# Altium schematic sheet Thermal_CCM.SchDoc: =project_title
size Tabloid; PageSetup: Record=PageOptions|CenterHorizontal=True|CenterVertical=True|PrintScale=0.71|XCorrection=1.00|YCorrection=1.00|PrintKind=0|BorderSize=5000000|LeftOffset=0|BottomOffset=0|Orientation=2|PaperLength=1000|PaperWidth=1000|Scale=100|PaperSource=7|PrintQuality=-4|MediaType=1|DitherType=10|PrintScaleMode=1|PaperKind=A4; CompanyName: Luxonis Holding; Organization: Luxonis Holding; Address1: 1925 Harmony Park Drive; Address2: Westminster, CO; Address3: 80234; Address4: United States; SheetNumber: 13; SheetTotal: 13
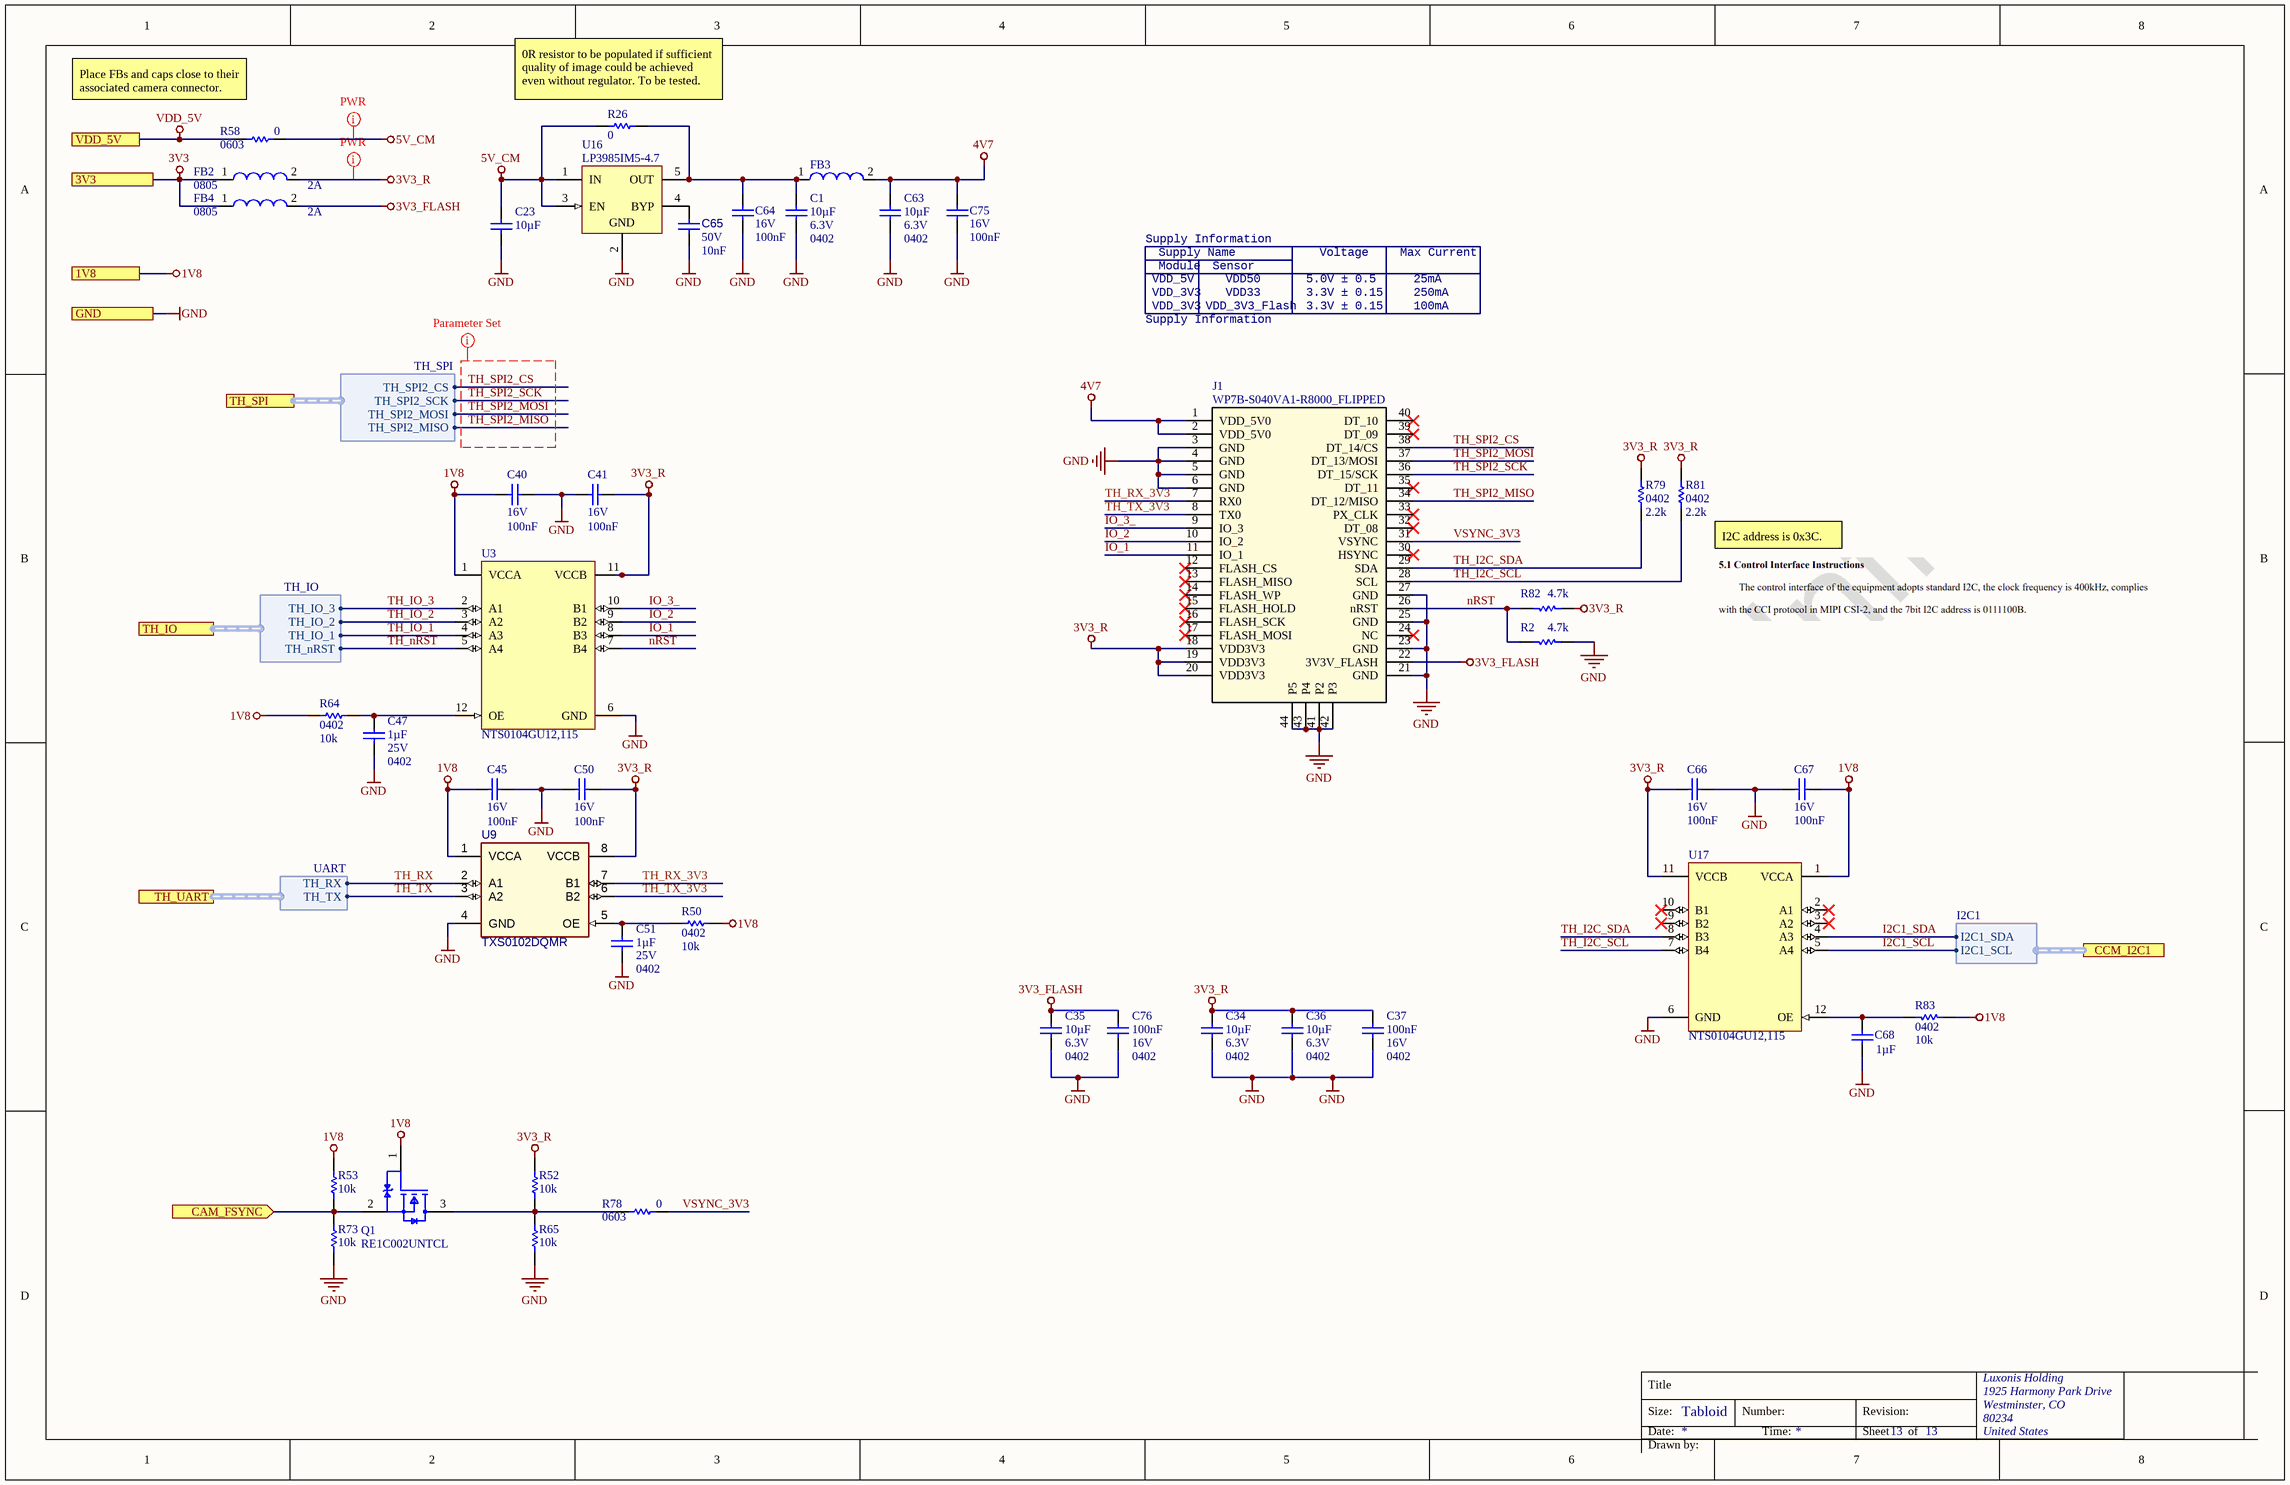
[diagram p0: Thermal_CCM.SchDoc]

## Parts
C1  value 10µF  Voltage Rating: 6.3V  Case/Package: 0402  [CAPC0402(1005)70_N]  (hidden comment: GRM155R60J106ME15D)
C23  value 10µF  [CAPC0402(1005)70_L]  (hidden comment: GRM155R60J106ME15D)
C34  value 10µF  Voltage Rating: 6.3V  Case/Package: 0402  [CAPC0402(1005)70_L]  (hidden comment: GRM155R60J106ME15D)
C35  value 10µF  Voltage Rating: 6.3V  Case/Package: 0402  [CAPC0402(1005)70_L]  (hidden comment: GRM155R60J106ME15D)
C36  value 10µF  Voltage Rating: 6.3V  Case/Package: 0402  [CAPC0402(1005)70_L]  (hidden comment: GRM155R60J106ME15D)
C37  value 100nF  Voltage Rating: 16V  Case/Package: 0402  [CAPC0402(1005)60_L]  (hidden comment: CL05B104KO5NFNC)
C40  value 100nF  Voltage Rating: 16V  [CAPC0402(1005)60_L]  (hidden comment: CL05B104KO5NFNC)
C41  value 100nF  Voltage Rating: 16V  [CAPC0402(1005)60_L]  (hidden comment: CL05B104KO5NFNC)
C45  value 100nF  Voltage Rating: 16V  [CAPC0402(1005)60_L]  (hidden comment: CL05B104KO5NFNC)
C47  value 1µF  Voltage Rating: 25V  Case/Package: 0402  [CAPC0402(1005)70_L]  (hidden comment: GRM155R61E105KA12D)
C50  value 100nF  Voltage Rating: 16V  [CAPC0402(1005)60_L]  (hidden comment: CL05B104KO5NFNC)
C51  value 1µF  Voltage Rating: 25V  Case/Package: 0402  [CAPC0402(1005)70_L]  (hidden comment: GRM155R61E105KA12D)
C63  value 10µF  Voltage Rating: 6.3V  Case/Package: 0402  [CAPC0402(1005)70_N]  (hidden comment: GRM155R60J106ME15D)
C64  value 100nF  Voltage Rating: 16V  [CAPC0402(1005)60_N]  (hidden comment: CL05B104KO5NFNC)
C65  value 10nF  Voltage Rating: 50V  [CAPC0402(1005)60_L]  (hidden comment: C0402C103K5RACTU)
C66  value 100nF  Voltage Rating: 16V  [CAPC0402(1005)60_L]  (hidden comment: CL05B104KO5NFNC)
C67  value 100nF  Voltage Rating: 16V  [CAPC0402(1005)60_L]  (hidden comment: CL05B104KO5NFNC)
C68  value 1µF  [CAPC0402(1005)70_L]  (hidden comment: GRM155R61E105KA12D)
C75  value 100nF  Voltage Rating: 16V  [CAPC0402(1005)60_N]  (hidden comment: CL05B104KO5NFNC)
C76  value 100nF  Voltage Rating: 16V  Case/Package: 0402  [CAPC0402(1005)60_L]  (hidden comment: CL05B104KO5NFNC)
FB2  Current Rating: 2A  Case/Package: 0805  [2508056017Y2]  (hidden comment: 2508056017Y2)
FB3  2508056017Y2  [2508056017Y2]  (value not drawn)
FB4  Current Rating: 2A  Case/Package: 0805  [2508056017Y2]  (hidden comment: 2508056017Y2)
J1  WP7B-S040VA1-R8000_FLIPPED  [WP7B-S040VA1-R8000-Edge mount]
Q1  RE1C002UNTCL  [RE1C002UNTCL]
R2  value 4.7k  [RESC0402(1005)_L]  (hidden comment: RC0402FR-074K7L)
R26  value 0  [RESC0603(1608)_N]  (hidden comment: CRCW06030000Z0EA)
R50  value 10k  Case/Package: 0402  [RESC0402(1005)_L]  (hidden comment: RC0402FR-1310KL)
R52  value 10k  [RESC0402(1005)_L]  (hidden comment: RC0402FR-1310KL)
R53  value 10k  [RESC0402(1005)_L]  (hidden comment: RC0402FR-1310KL)
R58  value 0  Case/Package: 0603  [RESC0603(1608)_N]  (hidden comment: CRCW06030000Z0EA)
R64  value 10k  Case/Package: 0402  [RESC0402(1005)_L]  (hidden comment: RC0402FR-1310KL)
R65  value 10k  [RESC0402(1005)_L]  (hidden comment: RC0402FR-1310KL)
R73  value 10k  [RESC0402(1005)_L]  (hidden comment: RC0402FR-1310KL)
R78  value 0  Case/Package: 0603  [RESC0603(1608)_N]  (hidden comment: CRCW06030000Z0EA)
R79  value 2.2k  Case/Package: 0402  [RESC0402(1005)_L]  (hidden comment: RC0402FR-072K2L)
R81  value 2.2k  Case/Package: 0402  [RESC0402(1005)_L]  (hidden comment: RC0402FR-072K2L)
R82  value 4.7k  [RESC0402(1005)_L]  (hidden comment: RC0402FR-074K7L)
R83  value 10k  Case/Package: 0402  [RESC0402(1005)_L]  (hidden comment: RC0402FR-1310KL)
U3  NTS0104GU12,115  [QFN40P170X200X50-12N]
U9  TXS0102DQMR  [DQM]
U16  LP3985IM5-4.7  [DBV0005A_L]
U17  NTS0104GU12,115  [QFN40P170X200X50-12N]

## Ports
1V8, 3V3, CAM_FSYNC (in), CCM_I2C1 (harness I2C1), GND, TH_IO (harness TH_IO), TH_SPI (harness TH_SPI), TH_UART (harness UART), VDD_5V

## Harnesses
UART: TH_RX, TH_TX
I2C1: I2C1_SDA, I2C1_SCL
TH_IO: TH_IO_3, TH_IO_2, TH_IO_1, TH_nRST
TH_SPI: TH_SPI2_CS, TH_SPI2_SCK, TH_SPI2_MOSI, TH_SPI2_MISO

## Nets
1V8: C40.2 C45.2 C67.2 Q1.1(Gate) R50.2 R53.2 R64.2 R83.2 U3.1(VCCA) U9.1(VCCA) U17.1(VCCA) ; port 1V8
3V3: FB2.1 FB4.1 ; port 3V3
3V3_FLASH: C35.2 C76.2 FB4.2 J1.22(3V3V_FLASH)
3V3_R: C34.2 C36.2 C37.2 C41.1 C50.1 C66.1 FB2.2 J1.18(VDD3V3) J1.19(VDD3V3) J1.20(VDD3V3) R52.2 R79.2 R81.2 R82.2 U3.11(VCCB) U9.8(VCCB) U17.11(VCCB)
4V7: C63.2 C75.1 FB3.2 J1.1(VDD_5V0) J1.2(VDD_5V0)
5V_CM: C23.2 R26.1 R58.2 U16.1(IN) U16.3(EN)
GND: C1.1 C23.1 C34.1 C35.1 C36.1 C37.1 C40.1 C41.2 C45.1 C47.1 C50.2 C51.1 C63.1 C64.2 C65.1 C66.2 C67.1 C68.1 C75.2 C76.1 J1.3(GND) J1.4(GND) J1.5(GND) J1.6(GND) J1.21(GND) J1.23(GND) J1.25(GND) J1.27(GND) J1.41(P2) J1.42(P3) J1.43(P4) J1.44(P5) R2.2 R65.1 R73.1 U3.6(GND) U9.4(GND) U16.2(GND) U17.6(GND) ; port GND
VDD_5V: R58.1 ; port VDD_5V
CAM_FSYNC: Q1.2(Source) R53.1 R73.2 ; port CAM_FSYNC
I2C1_SCL: U17.5(A4) ; port CCM_I2C1.I2C1_SCL
I2C1_SDA: U17.4(A3) ; port CCM_I2C1.I2C1_SDA
IO_1: J1.11(IO_1) U3.8(B3)
IO_2: J1.10(IO_2) U3.9(B2)
IO_3_: J1.9(IO_3) U3.10(B1)
nRST: J1.26(nRST) R2.1 R82.1 U3.7(B4)
TH_I2C_SCL: J1.28(SCL) R81.1 U17.7(B4)
TH_I2C_SDA: J1.29(SDA) R79.1 U17.8(B3)
TH_IO_1: U3.4(A3) ; port TH_IO.TH_IO_1
TH_IO_2: U3.3(A2) ; port TH_IO.TH_IO_2
TH_IO_3: U3.2(A1) ; port TH_IO.TH_IO_3
TH_nRST: U3.5(A4) ; port TH_IO.TH_nRST
TH_RX: U9.2(A1) ; port TH_UART.TH_RX
TH_RX_3V3: J1.7(RX0) U9.7(B1)
TH_SPI2_CS: J1.38(DT_14/CS) ; port TH_SPI.TH_SPI2_CS
TH_SPI2_MISO: J1.34(DT_12/MISO) ; port TH_SPI.TH_SPI2_MISO
TH_SPI2_MOSI: J1.37(DT_13/MOSI) ; port TH_SPI.TH_SPI2_MOSI
TH_SPI2_SCK: J1.36(DT_15/SCK) ; port TH_SPI.TH_SPI2_SCK
TH_TX: U9.3(A2) ; port TH_UART.TH_TX
TH_TX_3V3: J1.8(TX0) U9.6(B2)
VSYNC_3V3: J1.31(VSYNC) R78.2
NetC1_2: C1.2 C64.1 FB3.1 R26.2 U16.5(OUT)
NetC47_2: C47.2 R64.1 U3.12(OE)
NetC51_2: C51.2 R50.1 U9.5(OE)
NetC65_2: C65.2 U16.4(BYP)
NetC68_2: C68.2 R83.1 U17.12(OE)
NetQ1_3: Q1.3(Drain) R52.1 R65.2 R78.1

Not connected (* = marked no-connect by the designer): J1 12(FLASH_CS)* 13(FLASH_MISO)* 14(FLASH_WP)* 15(FLASH_HOLD)* 16(FLASH_SCK)* 17(FLASH_MOSI)* 24(NC)* 30(HSYNC)* 32(DT_08)* 33(PX_CLK)* 35(DT_11)* 39(DT_09)* 40(DT_10)*; U17 2(A1)* 3(A2)* 9(B2)* 10(B1)*

## Layout directives
net class PWR; Current Rating: 200mA: 3V3_R, 5V_CM
net class TH_SPI: TH_SPI2_CS, TH_SPI2_MISO, TH_SPI2_MOSI, TH_SPI2_SCK

## Notes on the sheet
- (near R58) Place FBs and caps close to their associated camera connector.
- (near R26) 0R resistor to be populated if sufficient quality of image could be achieved even without regulator. To be tested.
- Supply Information
- VDD_5V
- VDD_3V3
- Supply Name
- Module
- Sensor
- VDD50
- VDD33
- 5.0V ± 0.5
- 3.3V ± 0.15
- Voltage
- Max Current
- 25mA
- 250mA
- VDD_3V3_Flash
- 100mA
- (near R81) I2C address is 0x3C.
- Title
- Size:
- Date:
- Tabloid
- Number:
- Time:
- Revision:
- Sheet
- of
- Drawn by:

## Library data of the parts
C1 C23 C34-C36 C63 = CMP-004-000009-5: CAP CER 10UF 6.3V X5R 0402 20%; Manufacturer 1: Murata; Dielectric: X5R; Manufacturer Part Number 1: GRM155R60J106ME15D; ComponentLink1URL: https://www.murata.com/~/media/webrenewal/support/library/catalog/products/capacitor/mlcc/c02e.ashx?la=en-us&src-supplier=Digi-Key; Design Item ID: GRM155R60J106ME15D; Tolerance: 20%; Width: 0.02inch; Length: 0.039inch; Mounting Technology: SMT; Min Operating Temperature: -55°C; Max Operating Temperature: 85°C; ComponentLink1Description: https://www.murata.com/~/media/webrenewal/support/library/catalog/products/capacitor/mlcc/c02e.ashx?la=en-us&src-supplier=Digi-Key
  C23: Voltage Rating: 6.3V; Case/Package: 0402
C37 C40 C41 C45 C50 C64 C66 C67 C75 C76 = CMP-108-000002-6: CAP CER 0.1UF 16V X7R 0402 10%; Manufacturer 1: Samsung; ComponentLink1URL: https://datasheet.ciiva.com/25767/cl05b104ko5nfnc-25767124.pdf?src-supplier=Digi-Key; Length: 1mm; Design Item ID: CL05B104KO5NFNC; Tolerance: 10%; Min Operating Temperature: -55°C; Width: 0.02inch; Dielectric: X7R; ComponentLink1Description: https://datasheet.ciiva.com/25767/cl05b104ko5nfnc-25767124.pdf?src-supplier=Digi-Key; Height: 0.5mm; Depth: 0.5mm; Manufacturer Part Number 1: CL05B104KO5NFNC; Max Operating Temperature: 125°C; Mounting Technology: SMT
  C40 C41 C45 C50 C64 C66 C67 C75: Case/Package: 0402
C47 C51 C68 = CMP-108-000014-5: CAP CER 1UF 25V X5R 0402 10%; Manufacturer 1: Murata; ComponentLink2Description: https://datasheet.ciiva.com/7719/1666664-7719006.pdf?src-supplier=Element14; ComponentLink2URL: https://datasheet.ciiva.com/7719/1666664-7719006.pdf?src-supplier=Element14; Max Operating Temperature: 85°C; Depth: 0.5mm; Mounting Technology: SMT; ComponentLink1URL: https://datasheet.ciiva.com/22732/1666664-22732122.pdf?src-supplier=Element14; Length: 1mm; ComponentLink1Description: https://datasheet.ciiva.com/22732/1666664-22732122.pdf?src-supplier=Element14; Manufacturer Part Number 1: GRM155R61E105KA12D; Tolerance: 10%; Design Item ID: GRM155R61E105KA12D; Dielectric: X5R; Min Operating Temperature: -55°C; Height: 0.5mm; Width: 0.5mm
  C68: Voltage Rating: 25V; Case/Package: 0402
C65 = CMP-001-00069-12: CAP CER 10nF 50V X7R 0402 5%; Manufacturer 1: Kemet; Capacitor Type: Ceramic; Mounting Technology: SMT; Dielectric: X7R; Min Operating Temperature: -55°C; Tolerance: 5%; Manufacturer Part Number 1: C0402C103K5RACTU; Supplier 1: Digikey; Case/Package: 0402; Supplier Part Number 1: 399-C0402C103K5RAC7867TR-ND; Max Operating Temperature: 85°C
FB2-FB4 = CMP-082-000000-2: FERRITE BEAD, 0.1OHM, 2A, 0805, 600R/100MHz; Manufacturer 1: Fair-Rite; Tolerance: 25%; Manufacturer Part Number 1: 2508056017Y2
  FB3: Case/Package: 0805; Current Rating: 2A
J1 = CMP-002-00200-4: 40 pin connector used for thermal Tiny1C, Female, flipped, to be used with FPC connector where flipping is needed.; Manufacturer 1: JAE; Max Current Rating: 300mA; Voltage Rating: 50V; Gender: Receptacle; Min Operating Temperature: -40°C; Max Operating Temperature: 85°C; Connector Type: Female; System: connector; Mounting Technology: SMT; Manufacturer Part Number 1: WP7B-S040VA1-R8000; Pins: 40
Q1 = CMP-120-000001-2: MOSFET N-CH 20V 0.2A EMT3; Manufacturer 1: Rohm; Continuous Drain Current: 200mA; Case/Package: SOT-89; Manufacturer Part Number 1: RE1C002UNTCL; Design Item ID: RE1C002UNTCL; Max Drain to Source Voltage: 20V
R2 R82 = CMP-013-000016-9: RES SMD 4.7K OHM 1% 1/16W 0402; Manufacturer 1: Yageo; Power Rating: 62.5mW; Voltage Rating: 50V; Case/Package: 0402; Min Operating Temperature: -55°C; Manufacturer Part Number 1: RC0402FR-074K7L; Tolerance: 1%; Design Item ID: RC0402FR-074K7L; Max Operating Temperature: 155°C
R26 = CMP-115-000011-7: RES SMD 0 OHM 5% 1/10W 0603; Manufacturer 1: Vishay; Manufacturer Part Number 1: CRCW0603-0000Z0EA; Voltage Rating: 75V; Temperature Coefficient: 100ppm/°C; Power Rating: 100mW; Case/Package: 0603; Design Item ID: CRCW06030000Z0EA; Max Operating Temperature: 155°C; Min Operating Temperature: -55°C; Tolerance: 5%
R50 R52 R53 R64 R65 R73 R83 = CMP-115-000004-8: RES SMD 10K OHM 1% 1/16W 0402; Manufacturer 1: Yageo; Power Rating: 62.5mW; Temperature Coefficient: 100ppm/°C; Voltage Rating: 50V; Min Operating Temperature: -55°C; Max Operating Temperature: 155°C; Design Item ID: RC0402FR-1310KL; Tolerance: 1%; Manufacturer Part Number 1: RC0402FR-1310KL
  R52 R53 R65 R73: Case/Package: 0402
R58 R78 = CMP-115-000011-7: RES SMD 0 OHM 5% 1/10W 0603; Manufacturer 1: Vishay; Manufacturer Part Number 1: CRCW0603-0000Z0EA; Temperature Coefficient: 100ppm/°C; Power Rating: 100mW; Voltage Rating: 75V; Tolerance: 5%; Design Item ID: CRCW06030000Z0EA; Max Operating Temperature: 155°C; Min Operating Temperature: -55°C
R79 R81 = CMP-013-000013-8: RES SMD 2.2K OHM 1% 1/16W 0402; Manufacturer 1: Yageo; Voltage Rating: 50V; Power Rating: 63mW; Tolerance: 1%; Max Operating Temperature: 155°C; Manufacturer Part Number 1: RC0402FR-072K2L; Min Operating Temperature: -55°C; Design Item ID: RC0402FR-072K2L
U3 U17 = CMP-163-000000-6: Voltage Level Translator Bidirectional 1 Circuit 4 Channel 50Mbps 12-XQFN _2x1.7_; Manufacturer 1: NXP USA; Manufacturer Part Number 1: NTS0104GU12,115
U9 = CMP-015-00002-5: IC TRANSLATOR VOLTAGE 8-X2SON; Manufacturer 1: Texas Instruments; Pins: 8; Manufacturer Part Number 1: TXS0102DQMR
U16 = CMP-00024-8: LDO Regulator Pos 4.7V 0.15A 5-Pin SOT-23 T/R; Manufacturer 1: Texas Instruments; Manufacturer Part Number 1: LP3985IM5-4.7/NOPB; Min Input Voltage: 2.5V; Accuracy: 2%; Output Configuration: Positive; Max Supply Current: 250uA; Quiescent Current: 150uA; Number of Outputs: 1; Output Current: 150mA; Min Current Limit: 300mA; Max Power Dissipation: 250mW; Output Type: Fixed; Power Supply Rejection Ratio (PSRR): 40dB; Current Rating: 150A; Max Supply Voltage: 6V; Dropout Voltage: 60mV; Vfb/Vout: 1V; Packaging: Tape and Reel; Min Operating Temperature: -40°C; Min Output Voltage: 4.7V; Lead Free: Contains Lead; Radiation Hardening: No; Polarity: Positive; Mounting Technology: Surface Mount; Number of Regulators: 1; Pins: 5; Max Operating Temperature: 125°C; Series: -; Max Output current: 150mA; Package Quantity: 1000; RoHS Compliant: No; Output Voltage: 4.7V; Case/Package: SOT-23-5; Max Input Voltage: 6V